# Altium project E-button.PrjPcb
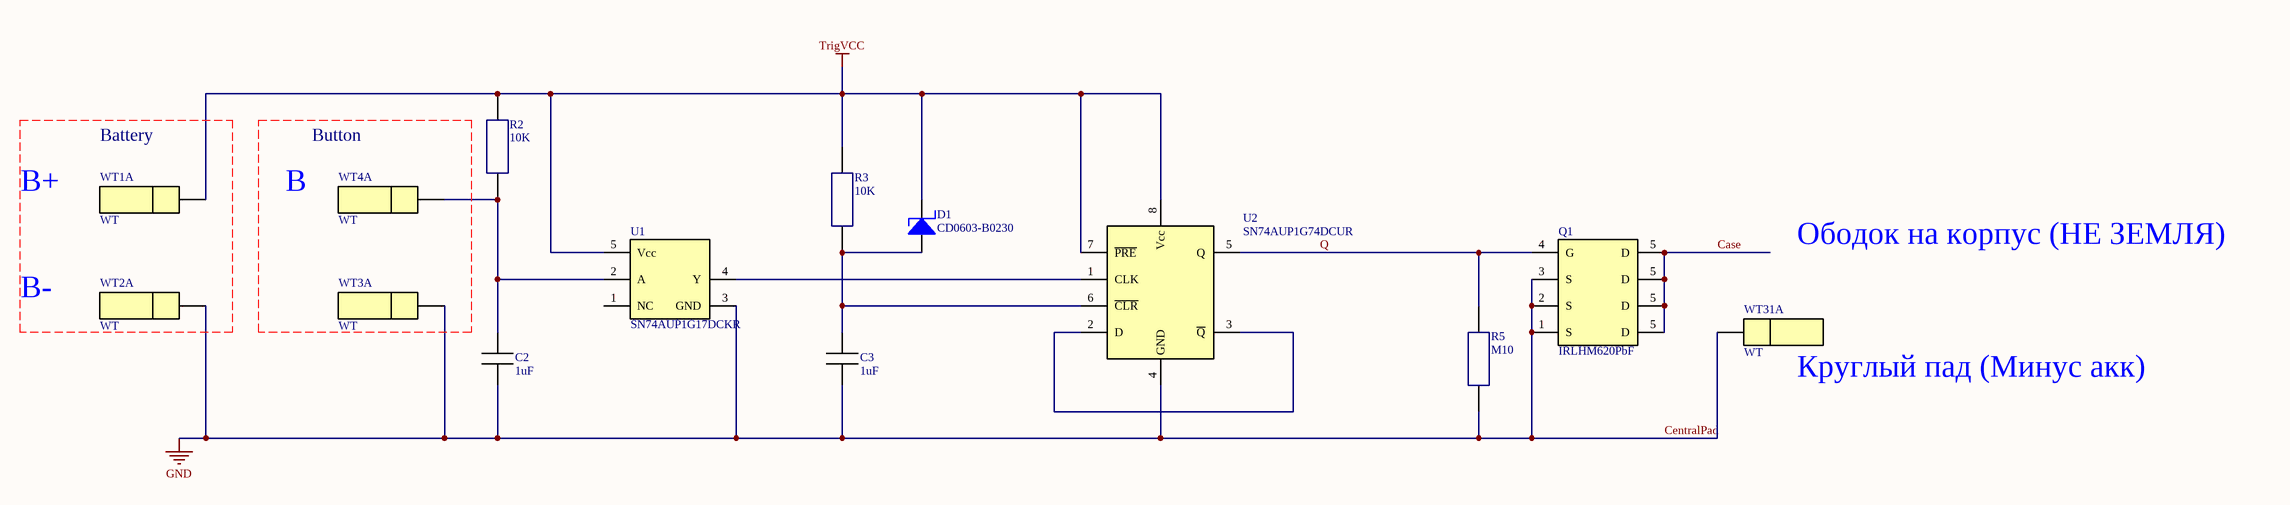
[diagram p0: Scheme_E-button(1).SchDoc]
1 sheet, 14 parts. Net scope: global (net labels, ports and power ports of the same name join across sheets).
Board file: PCB_E-button.PcbDoc

## Sheet Scheme_E-button(1).SchDoc
size A2

### Parts
C2  value 1uF  [Cap 0603]  (hidden comment: 1u0)
C3  value 1uF  [Cap 0603]  (hidden comment: 1u0)
D1  value CD0603-B0230  [0603]  (hidden comment: B5)
Q1  value IRLHM620PbF  [PQFN-8 3.3x3.3]  (hidden comment: IRLHM620)
R2  value 10K  [R0603 5%]  (hidden comment: 103)
R3  value 10K  [R0603 5%]  (hidden comment: 103)
R5  value M10  [R0603 5%]  (hidden comment: 104)
U1  value SN74AUP1G17DCKR  [SC-70-5]  (hidden comment: SN74AUP)
U2  value SN74AUP1G74DCUR  [VSSOP-8 2.3x2.3mm]  (hidden comment: SN74AUP)
WT1  value WT  [WT]  (hidden comment: *)  (part A of 2)
WT2  value WT  [WT]  (hidden comment: *)  (part A of 2)
WT3  value WT  [WT]  (hidden comment: *)  (part A of 2)
WT4  value WT  [WT]  (hidden comment: *)  (part A of 2)
WT31  value WT  [WT]  (hidden comment: *)  (part A of 2)

### Nets
CentralPad: C2.1 C3.1 Q1.1(S) Q1.2(S) Q1.3(S) R5.1 U1.3(GND) U2.4(GND) WT2.1 WT3.1 WT31.1  [also labelled GND]
TrigVCC: D1.1 R2.1 R3.1 U1.5(Vcc) U2.7(~{PRE}) U2.8(Vcc) WT1.1
Case: Q1.5(D)
Q: Q1.4(G) R5.2 U2.5(Q)
NetC2_2: C2.2 R2.2 U1.2(A) WT4.1
NetC3_2: C3.2 D1.2 R3.2 U2.6(~{CLR})
NetU1_4: U1.4(Y) U2.1(CLK)
NetU2_2: U2.2(D) U2.3(~{Q})

Not connected (* = marked no-connect by the designer): U1 1(NC)

### Notes on the sheet
- B+
- Battery
- B
- Button
- Ободок на корпус (НЕ ЗЕМЛЯ)
- B-
- Круглый пад (Минус акк)
- Title
- Size:
- Date:
- A4
- Number:
- Time:
- Revision:
- Sheet
- of
- File:

### Library data of the parts
C2 C3 = CMP-00074-4: C 1uF  x 25V; Component Name: Ceramic Capacitor, SMD, 0603, X7R, 1uF  x 25V 10%; Package: 0603; Marking: 1u0; Voltage: 25V
D1 = CMP-00791-1: CD0603-B0230; Component Name: Schottky Barrier Diodes, CD0603-B0230, 0603; ComponentLink1URL: https://www.mouser.com/ds/2/54/bcd0603_1005-778009.pdf; ComponentLink1Description: Datasheet; Mounting type: SMD; Marking: B5; Package: 0603
Q1 = CMP-00792-2: IRLHM620PbF; Component Name: HEXFET Power MOSFET, IRLHM620PbF , PQFN-8 3x3MM; ComponentLink1URL: https://www.infineon.com/dgdl/irlhm620pbf.pdf?fileId=5546d462533600a4015356638be325a3; ComponentLink1Description: Datasheet; Mounting type: SMD; Marking: IRLHM620; Package: PQFN-8 3x3
R2 R3 = CMP-00052-5: R 10K; Component Name: Fixed resistor, SMD, 0603, 10K 5%; Package: 0603; Marking: 103
R5 = CMP-00156-5: R M10; Component Name: Fixed resistor, SMD, 0603, 100K 5%; Marking: 104; Package: 0603
U1 = CMP-00831-1: SN74AUP1G17DCKR; Component Name: IC, Low-Power Single Schmitt-Trigger Buffer, SN74AUP1G17DCKR, SC-70-5; ComponentLink1URL: http://www.ti.com/lit/ds/symlink/sn74aup1g17.pdf; ComponentLink1Description: Datasheet; Mounting type: SMD; Marking: SN74AUP; Package: SC-70-5
U2 = CMP-00830-1: SN74AUP1G74DCUR; Component Name: IC, Low-Power Single Positive-Edge-Triggered D-Type Flip-Flop, SN74AUP1G74DCUR, VSSOP-8; ComponentLink1URL: http://www.ti.com/lit/ds/symlink/sn74aup1g74.pdf; ComponentLink1Description: Datasheet; Mounting type: SMD; Marking: SN74AUP; Package: VSSOP-8
WT1-WT4 WT31 = CMP-00159-3: WT; Component Name: Connector, WT; Package: WT; Marking: *; ComponentLink1Description: Datasheet; ComponentLink1URL: *; PartId: 1